# Altium schematic sheet LPCB223 - OVERVIEW.SchDoc
size A3; Address1: Factory 10; Address2: 9-13 Dingley Avenue, Dandeong, VICTORIA 3175, AUSTRALIA; DocumentNumber: 1; Revision: 1; SheetNumber: 1; SheetTotal: 6; Lockie__PCB_SUB_ASSEMBLY: Overview; Lockie__PCB_ASSEMBLY: Main; Lockie__LDL: LPCB223; Lockie__PCB_DESCRIPTION: Power Node
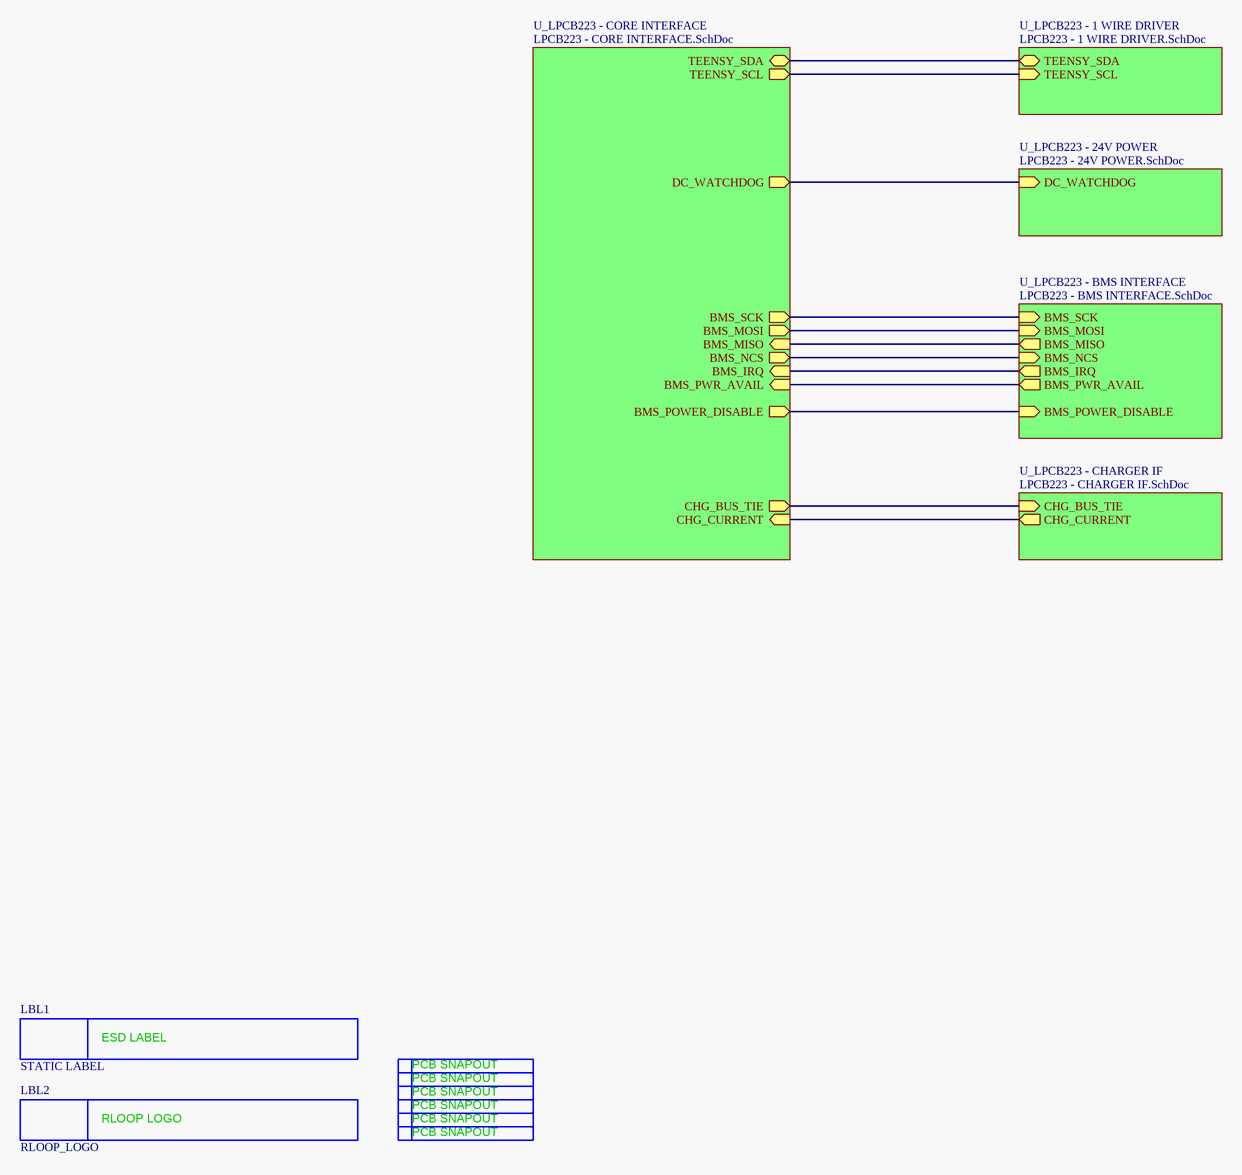
[diagram p0: LPCB223 - OVERVIEW.SchDoc]

## Parts
LBL1  STATIC LABEL  [STATIC_LABEL]  (no BOM)
LBL2  RLOOP_LOGO  [RLOOP_LOGO]  (no BOM)
SN1  PCB_SNAPOUT  [SNAPOUT_NEW]  (value not drawn)  (no BOM)
SN2  PCB_SNAPOUT  [SNAPOUT_NEW]  (value not drawn)  (no BOM)
SN3  PCB_SNAPOUT  [SNAPOUT_NEW]  (value not drawn)  (no BOM)
SN4  PCB_SNAPOUT  [SNAPOUT_NEW]  (value not drawn)  (no BOM)
SN5  PCB_SNAPOUT  [SNAPOUT_NEW]  (value not drawn)  (no BOM)
SN6  PCB_SNAPOUT  [SNAPOUT_NEW]  (value not drawn)  (no BOM)

## Sub-sheets
U_LPCB223 - 1 WIRE DRIVER = LPCB223 - 1 WIRE DRIVER.SchDoc: TEENSY_SDA (bidir), TEENSY_SCL (in)
U_LPCB223 - 24V POWER = LPCB223 - 24V POWER.SchDoc: DC_WATCHDOG (in)
U_LPCB223 - BMS INTERFACE = LPCB223 - BMS INTERFACE.SchDoc: BMS_MOSI (in), BMS_SCK (in), BMS_MISO (out), BMS_PWR_AVAIL (out), BMS_NCS (in), BMS_IRQ (out), BMS_POWER_DISABLE (in)
U_LPCB223 - CHARGER IF = LPCB223 - CHARGER IF.SchDoc: CHG_BUS_TIE (in), CHG_CURRENT (out)
U_LPCB223 - CORE INTERFACE = LPCB223 - CORE INTERFACE.SchDoc: BMS_MOSI (out), BMS_SCK (out), BMS_MISO (in), BMS_PWR_AVAIL (in), BMS_NCS (out), BMS_IRQ (in), DC_WATCHDOG (out), CHG_CURRENT (in), TEENSY_SDA (bidir), TEENSY_SCL (out), BMS_POWER_DISABLE (out), CHG_BUS_TIE (out)

## Nets
(unnamed): sheet U_LPCB223 - CORE INTERFACE/BMS_MOSI, sheet U_LPCB223 - BMS INTERFACE/BMS_MOSI
(unnamed): sheet U_LPCB223 - CORE INTERFACE/BMS_SCK, sheet U_LPCB223 - BMS INTERFACE/BMS_SCK
(unnamed): sheet U_LPCB223 - CORE INTERFACE/BMS_MISO, sheet U_LPCB223 - BMS INTERFACE/BMS_MISO
(unnamed): sheet U_LPCB223 - CORE INTERFACE/BMS_PWR_AVAIL, sheet U_LPCB223 - BMS INTERFACE/BMS_PWR_AVAIL
(unnamed): sheet U_LPCB223 - CORE INTERFACE/BMS_NCS, sheet U_LPCB223 - BMS INTERFACE/BMS_NCS
(unnamed): sheet U_LPCB223 - CORE INTERFACE/BMS_IRQ, sheet U_LPCB223 - BMS INTERFACE/BMS_IRQ
(unnamed): sheet U_LPCB223 - CORE INTERFACE/DC_WATCHDOG, sheet U_LPCB223 - 24V POWER/DC_WATCHDOG
(unnamed): sheet U_LPCB223 - CORE INTERFACE/CHG_CURRENT, sheet U_LPCB223 - CHARGER IF/CHG_CURRENT
(unnamed): sheet U_LPCB223 - CORE INTERFACE/TEENSY_SDA, sheet U_LPCB223 - 1 WIRE DRIVER/TEENSY_SDA
(unnamed): sheet U_LPCB223 - CORE INTERFACE/TEENSY_SCL, sheet U_LPCB223 - 1 WIRE DRIVER/TEENSY_SCL
(unnamed): sheet U_LPCB223 - CORE INTERFACE/BMS_POWER_DISABLE, sheet U_LPCB223 - BMS INTERFACE/BMS_POWER_DISABLE
(unnamed): sheet U_LPCB223 - CORE INTERFACE/CHG_BUS_TIE, sheet U_LPCB223 - CHARGER IF/CHG_BUS_TIE

## Notes on the sheet
- PCB COMPONENT DESCRIPTION
- LDL NUMBER
- Assembly Details
- Size
- Drawing File Name
- Revision
- http://rloop.org
- Scale
- A3
- Sheet Details
- N.T.S
- Sheet:
- Of:
- (in symbol PCB_SNAPOUT) PCB SNAPOUT
- (in symbol RLOOP_LOGO) RLOOP LOGO
- (in symbol STATIC LABEL) ESD LABEL

## Library data of the parts
LBL1 = STATIC LABEL: FMEDA__CHANNEL: DIAG; FMEDA__FUNCTION_IN_SYSTEM: *
LBL2 = RLOOP_LOGO: FMEDA__CHANNEL: DIAG; FMEDA__FUNCTION_IN_SYSTEM: *
SN1-SN6 = PCB_SNAPOUT: FMEDA__CHANNEL: DIAG; FMEDA__FUNCTION_IN_SYSTEM: *